# EAGLE schematic stm32_T12+858D (EAGLE 9.2.2)
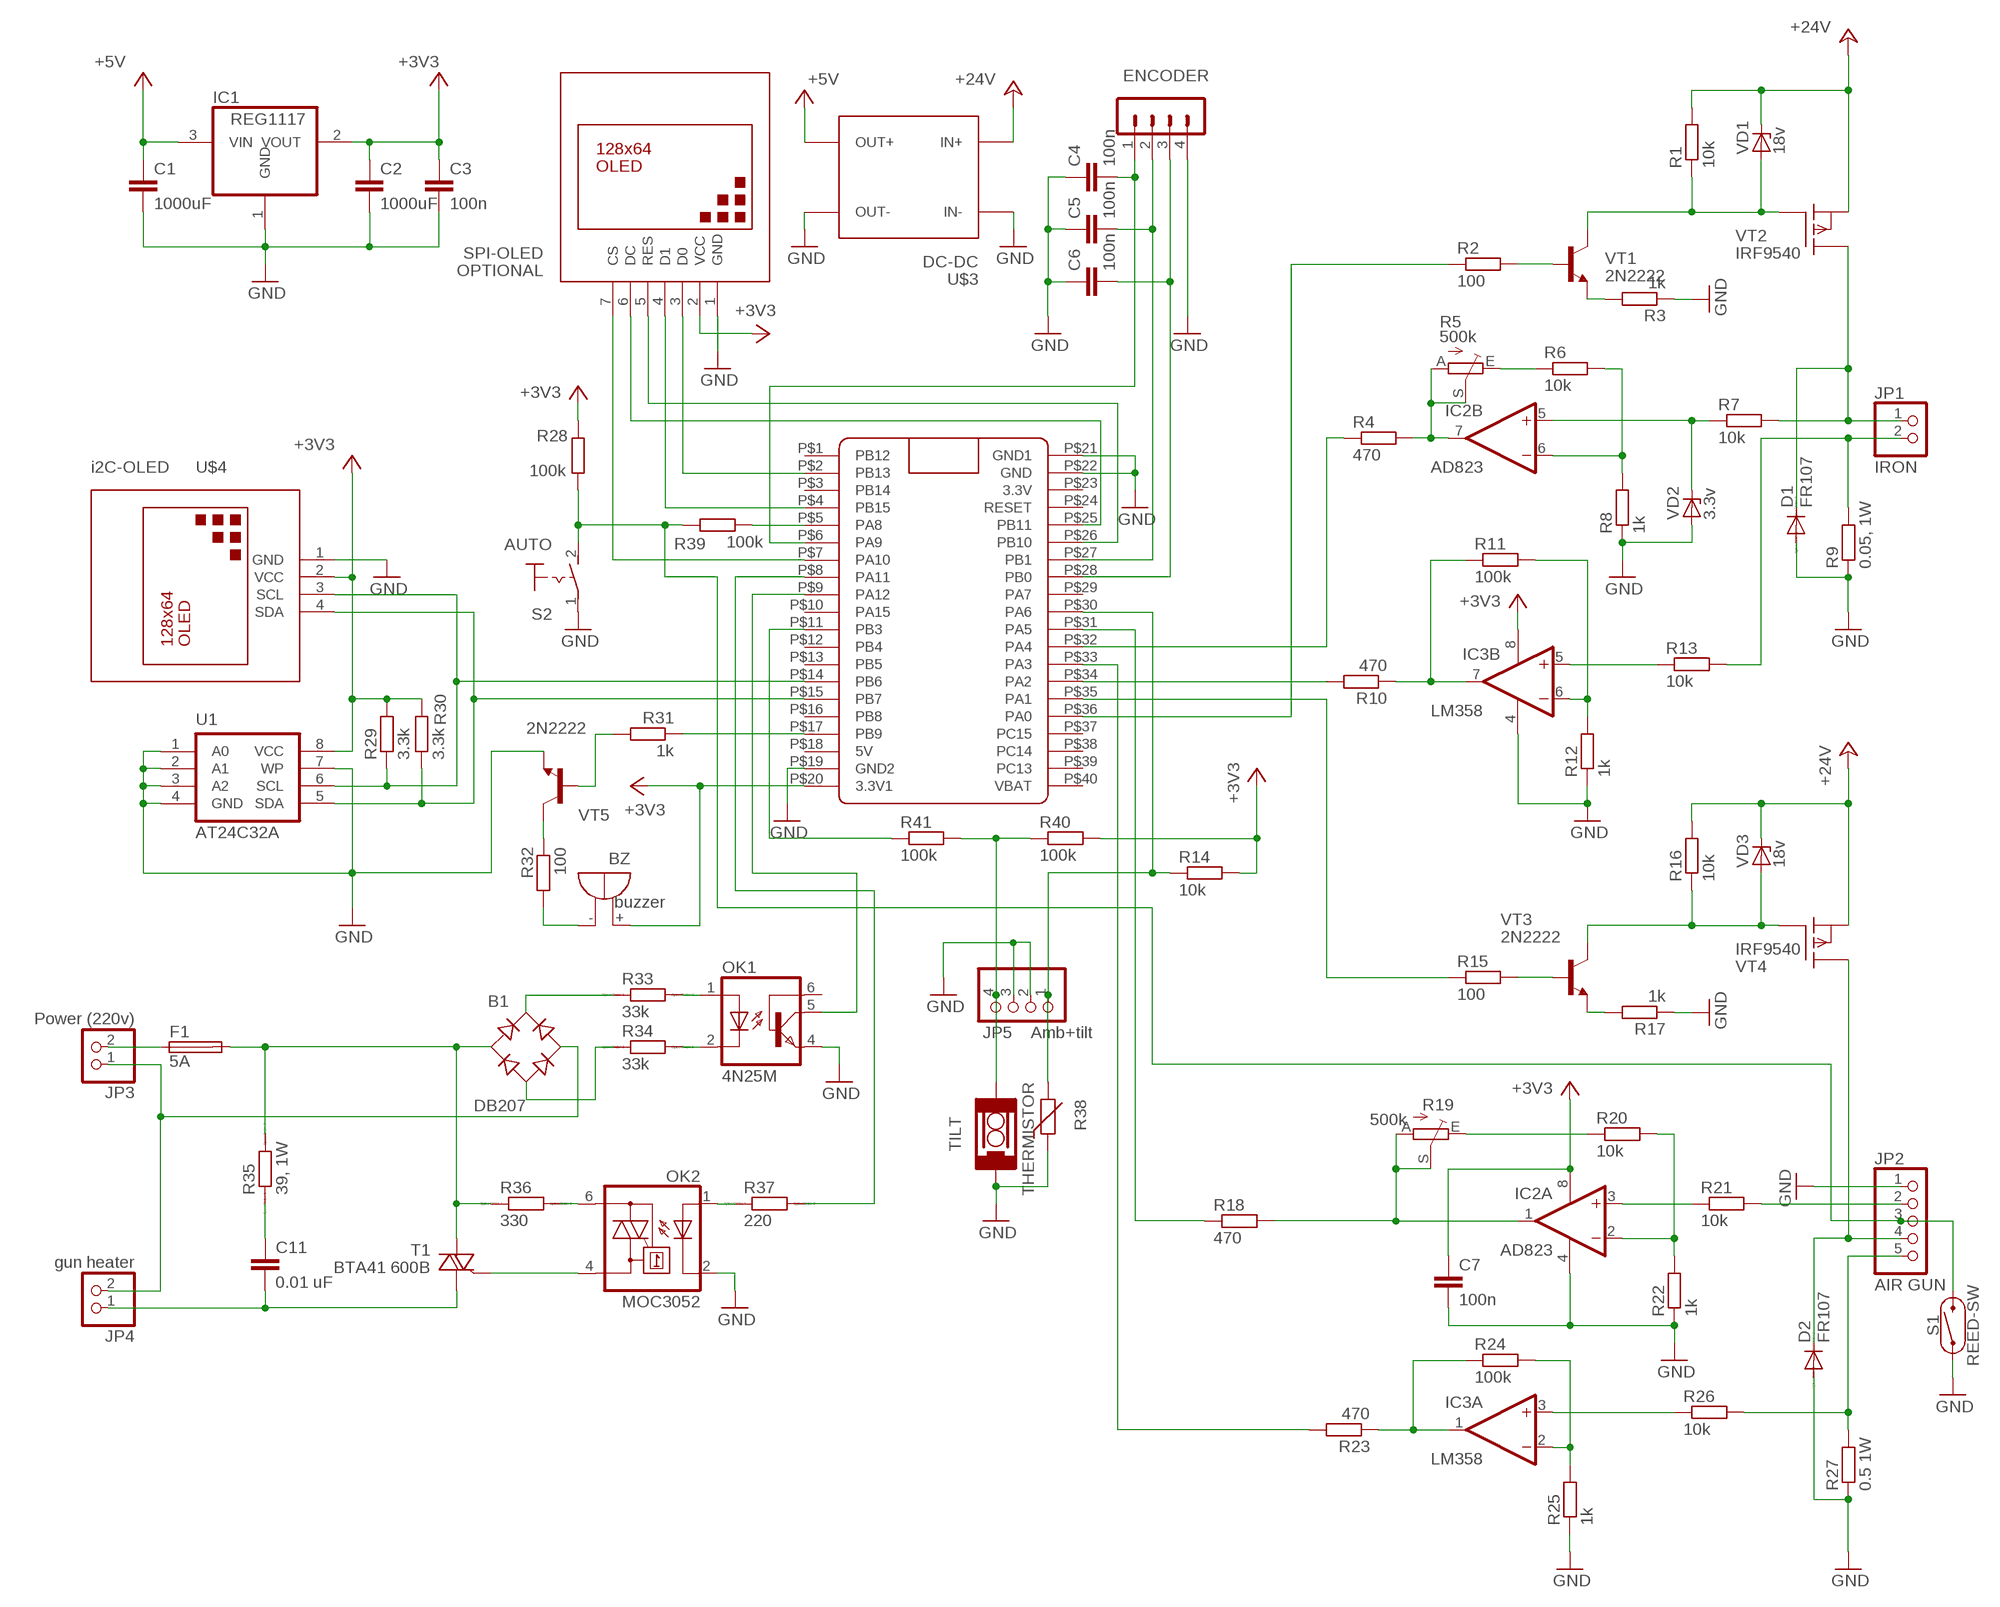
[diagram p0: schematic, sheet 1]

## Parts
B1  DB207  B-DIL  [B-DIL]
BZ  buzzer  EB2209A  [EB2209A]
C1  1000uF  C-EU025-025X050  [C025-025X050]
C2  1000uF  C-EU025-025X050  [C025-025X050]
C3  100n  C-EU025-025X050  [C025-025X050]
C4  100n  C-EU025-025X050  [C025-025X050]
C5  100n  C-EU025-025X050  [C025-025X050]
C6  100n  C-EU025-025X050  [C025-025X050]
C7  100n  C-EU025-025X050  [C025-025X050]
C11  0.01 uF  C-EU050-024X044  [C050-024X044]
D1  FR107  1N4004  [DO41-10]
D2  FR107  1N4004  [DO41-10]
ENCODER  MA04-1  [MA04-1]
F1  5A  TE5  [TE5]
IC1  REG1117  [SOT223]
IC2  AD823  MCP602P  [DIL08]
IC3  LM358  MCP602P  [DIL08]
JP1  IRON  PINHD-1X2  [1X02]
JP2  AIR GUN  PINHD-1X5  [1X05]
JP3  Power (220v)  PINHD-1X2  [1X02]
JP4  gun heater  PINHD-1X2  [1X02]
JP5  Amb+tilt  PINHD-1X4  [1X04]
OK1  4N25M  [DIL06]
OK2  MOC3052  MOC3021M  [DIL06]
OPTIONAL  SPI-OLED  DISPLAY-OLED-128X64  [DISPLAY-OLED-128X64]
R1  10k  R-EU_0204/5  [0204/5]
R2  100  R-EU_0204/5  [0204/5]
R3  1k  R-EU_0204/5  [0204/5]
R4  470  R-EU_0204/5  [0204/5]
R5  500k  TRIM_EU-RJ9W  [RJ9W]
R6  10k  R-EU_0204/5  [0204/5]
R7  10k  R-EU_0204/5  [0204/5]
R8  1k  R-EU_0204/5  [0204/5]
R9  0.05, 1W  R-EU_0204/5  [0204/5]
R10  470  R-EU_0204/5  [0204/5]
R11  100k  R-EU_0204/5  [0204/5]
R12  1k  R-EU_0204/5  [0204/5]
R13  10k  R-EU_0204/5  [0204/5]
R14  10k  R-EU_0204/5  [0204/5]
R15  100  R-EU_0204/5  [0204/5]
R16  10k  R-EU_0204/5  [0204/5]
R17  1k  R-EU_0204/5  [0204/5]
R18  470  R-EU_0204/5  [0204/5]
R19  500k  TRIM_EU-RJ9W  [RJ9W]
R20  10k  R-EU_0204/5  [0204/5]
R21  10k  R-EU_0204/5  [0204/5]
R22  1k  R-EU_0204/5  [0204/5]
R23  470  R-EU_0204/5  [0204/5]
R24  100k  R-EU_0204/5  [0204/5]
R25  1k  R-EU_0204/5  [0204/5]
R26  10k  R-EU_0204/5  [0204/5]
R27  0.5 1W  R-EU_0204/5  [0204/5]
R28  100k  R-EU_0204/5  [0204/5]
R29  3.3k  R-EU_0204/5  [0204/5]
R30  3.3k  R-EU_0204/5  [0204/5]
R31  1k  R-EU_0204/5  [0204/5]
R32  100  R-EU_0204/5  [0204/5]
R33  33k  R0204/7  [0204/7]
R34  33k  R0204/7  [0204/7]
R35  39, 1W  R0204/7  [0204/7]
R36  330  R0204/7  [0204/7]
R37  220  R0204/7  [0204/7]
R38  THERMISTOR  THERMISTOR-2,5  [RS-2,5]
R39  100k  R-EU_0204/5  [0204/5]
R40  100k  R-EU_0204/5  [0204/5]
R41  100k  R-EU_0204/5  [0204/5]
S1  REED-SW  REED_SWITCH-PTH-GLASS  [REED_SWITCH_GLASS]
S2  AUTO  MS243  [MS243]
T1  BTA41 600B  BTA26-H  [TOP3L-1]
TILT  SQ-SEN-200  [SQ-SEN-200]
U1  AT24C32A  AT24CXX-8S1  [SO08-8S1]
U$1  BLUE_PILL  [BLUE_PILL]
U$3  DC-DC  DC-DC-STEP-DOWN-MP2307  [DC-DC-STEP-DOWN-MP2307]
U$4  i2C-OLED  DISPLAY-OLED-128X64-I2C  [DISPLAY-OLED-128X64-I2C]
VD1  18v  ZENER-DIODEDO34-7  [DO34Z7]
VD2  3.3v  ZENER-DIODEDO34-7  [DO34Z7]
VD3  18v  ZENER-DIODEDO34-7  [DO34Z7]
VT1  2N2222  [TO18]
VT2  IRF9540  IRF9530  [TO220]
VT3  2N2222  [TO18]
VT4  IRF9540  IRF9530  [TO220]
VT5  2N2222  [TO18]

## Nets
+3V3: BZ.+ C2.1 C3.1 C7.1 IC1.2(VOUT) IC2.8(P:V+) IC3.8(P:V+) OPTIONAL.2(VCC) R14.2 R28.2 R29.2 R30.2 R40.2 U1.8(VCC) U$1.P$20(3.3V1) U$4.2(VCC)
+5V: C1.1 IC1.3(VIN) U$3.OUT+
+24V: R1.2 R16.2 U$3.IN+ VD1.C VD3.C VT2.3(S) VT4.3(S)
GND: C1.2 C2.2 C3.2 C4.1 C5.1 C6.1 D1.A D2.A ENCODER.4 IC1.1(GND) IC3.4(P:V-) JP2.1 JP5.2 JP5.3 OK1.4(EMI) OK2.2(C) OPTIONAL.1(GND) R3.1 R9.1 R12.1 R17.1 R25.1 R27.1 R38.1 S1.P$1 S2.1(P) TILT.1 U1.1(A0) U1.2(A1) U1.3(A2) U1.4(GND) U1.7(WP) U$1.P$19(GND2) U$1.P$21(GND1) U$1.P$22(GND) U$3.IN- U$3.OUT- U$4.1(GND) VT5.1(E)
N$1: R30.1 U1.5(SDA) U$1.P$15(PB7) U$4.4(SDA)
N$2: R29.1 U1.6(SCL) U$1.P$14(PB6) U$4.3(SCL)
N$3: OPTIONAL.7(CS) U$1.P$7(PA10)
N$4: OPTIONAL.6(DC) U$1.P$25(PB11)
N$5: OPTIONAL.5(RES) U$1.P$26(PB10)
N$6: OPTIONAL.4(D1) U$1.P$4(PB15)
N$7: OPTIONAL.3(D0) U$1.P$2(PB13)
N$8: R31.1 U$1.P$17(PB9)
N$9: C6.2 ENCODER.3 U$1.P$28(PB0)
N$10: C5.2 ENCODER.2 U$1.P$27(PB1)
N$11: C4.2 ENCODER.1 U$1.P$6(PA9)
N$12: R5.E R6.1
N$13: R4.1 U$1.P$32(PA4)
N$14: IC2.6(B:-IN) R6.2 R8.2
N$15: IC2.5(B:+IN) R7.1 VD2.C
N$16: D1.C JP1.1 R7.2 VT2.2(D)
N$17: IC2.3(A:+IN) R21.1
N$18: IC3.7(B:OUT) R10.1 R11.1
N$19: IC3.6(B:-IN) R11.2 R12.2
N$20: IC2.7(B:OUT) R4.2 R5.A R5.S
N$21: R10.2 U$1.P$34(PA2)
N$22: IC3.5(B:+IN) R13.1
N$23: R1.1 VD1.A VT1.3(C) VT2.1(G)
N$24: IC2.2(A:-IN) R20.2 R22.2
N$25: R23.2 U$1.P$33(PA3)
N$26: R3.2 VT1.1(E)
N$27: R2.2 VT1.2(B)
N$28: R2.1 U$1.P$36(PA0)
N$29: JP5.1 R14.1 R38.2 U$1.P$30(PA6)
N$30: R31.2 VT5.2(B)
N$31: D2.C JP2.4 VT4.2(D)
N$32: IC3.1(A:OUT) R23.1 R24.1
N$33: IC3.2(A:-IN) R24.2 R25.2
N$34: JP1.2 R9.2 R13.2
N$35: JP2.2 R21.2
N$36: JP2.3 R28.1 R39.1 S1.P$2 S2.2(S)
N$37: BZ.- R32.2
N$39: IC2.1(A:OUT) R18.2 R19.A R19.S
N$40: B1.AC2 JP3.1 JP4.2
N$41: IC3.3(A:+IN) R26.1
N$42: R19.E R20.1
N$43: R18.1 U$1.P$31(PA5)
N$44: C11.2 JP4.1 T1.A1
N$45: C11.1 R35.1
N$46: B1.AC1 F1.2 R35.2 R36.1 T1.A2
N$47: OK2.4(A1) T1.G
N$48: OK2.6(A2) R36.2
N$49: OK2.1(A) R37.1
N$50: R16.1 VD3.A VT3.3(C) VT4.1(G)
N$51: B1.+ R33.1
N$52: OK1.1(A) R33.2
N$53: OK1.2(C) R34.2
N$54: B1.- R34.1
N$55: OK1.5(COL) U$1.P$9(PA12)
N$56: R17.2 VT3.1(E)
N$57: R15.2 VT3.2(B)
N$58: R15.1 U$1.P$35(PA1)
N$59: R32.1 VT5.3(C)
N$60: R37.2 U$1.P$8(PA11)
N$61: JP2.5 R26.2 R27.2
N$62: F1.1 JP3.2
N$63: R41.1 U$1.P$11(PB3)
N$64: JP5.4 R40.1 R41.2 TILT.2
N$65: R39.2 U$1.P$5(PA8)
VD3: C7.2 IC2.4(P:V-) R8.1 R22.1 VD2.A ; supply symbol labelled GND
Unconnected: OK1.6(BAS) U$1.P$1(PB12) U$1.P$3(PB14) U$1.P$10(PA15) U$1.P$12(PB4) U$1.P$13(PB5) U$1.P$16(PB8) U$1.P$18(5V) U$1.P$23(3.3V) U$1.P$24(RESET) U$1.P$29(PA7) U$1.P$37(PC15) U$1.P$38(PC14) U$1.P$39(PC13) U$1.P$40(VBAT)

## Library data of the parts
B1 = rectifier:B-DIL: RECTIFIER
BZ = buzzer:EB2209A: BUZZER Source: Buerklin; OC_FARNELL: unknown; OC_NEWARK: unknown
C1-C7 C11 = rcl:C-EU: CAPACITOR, European symbol; SPICEPREFIX: C
D1 D2 = diode:1N4004: DIODE general purpose rectifier, 1 A
ENCODER = con-lstb:MA04-1: PIN HEADER; OC_FARNELL: unknown; OC_NEWARK: unknown
F1 = fuse:TE5: FUSE Wickmann; OC_FARNELL: unknown; OC_NEWARK: unknown
IC1 = burr-brown:REG1117: 800mA and 1A Low Dropout (LDO) Positive Regulator 1.8V, 2.5V, 2.85V, 3.3V, 5V, and Adj; MPN: REG1117; OC_FARNELL: 1097566; OC_NEWARK: 14P6981
IC2 IC3 = linear:MCP602: Single Op Amp 2.7V to 6.0V Single Supply CMOS Source: http://ww1.microchip.com/downloads/en/DeviceDoc/21314g.pdf
JP1 JP3 JP4 = pinhead:PINHD-1X2: PIN HEADER
JP2 = pinhead:PINHD-1X5: PIN HEADER
JP5 = pinhead:PINHD-1X4: PIN HEADER
OK1 = optocoupler:4N*?M: General Purpose 6-Pin Phototransistor Optocouplers Source: http://www.fairchildsemi.com/ds/4N/4N35-M.pdf; MPN: 4N25-M; OC_FARNELL: 1021349; OC_NEWARK: 98K9084
OK2 = optocoupler:MOC30*M: RANDOM-PHASE OPTOISOLATORS TRIAC DRIVER OUTPUT Source: http://www.fairchildsemi.com MOC3020-M.pdf; MF: FAIRCHILD SEMICONDUCTOR; MPN: MOC3021-M; OC_FARNELL: 1021365; OC_NEWARK: 95B7895
OPTIONAL = diy-modules:DISPLAY-OLED-128X64: 128x64 Dot Matrix OLED Module based on SSD1306 chip Variant with SPI interface More details available here: http://www.instructables.com/id/How-to-use-OLED-display-arduino-module/ SSD1306 datasheet: https://cdn-shop.adafruit.com/datasheets/SSD1306.pdf Click here to find device on ebay.com <http://www.ebay.com/sch/oled+display+128x64> Note: There are two variants: I2C and SPI. Search for the proper version.
R1-R4 R6-R18 R20-R32 R39-R41 = rcl:R-EU_: RESISTOR, European symbol; SPICEPREFIX: R
R5 R19 = pot:TRIM_EU-: POTENTIOMETER
R33-R37 = eagle-ltspice:R: RESISTOR, European symbol; SPICEMODEL: NONE; SPICEPREFIX: R
R38 = varistor:THERMISTOR: THERMISTOR
S1 = SparkFun-Switches:REED_SWITCH: Reed Switch A reed switch is a magnetically-actuated switch. When the device is exposed to a magnetic field, the two ferrous materials inside the switch pull together and the switch closes. Variant Overview PTH-GLASS Reed Switch <https://www.sparkfun.com/products/8642> (COM-08642) - PTH reed switch w/ glass body (6.0 x 0.9 mm) PTH-INSULATED Reed Switch - Insulated <https://www.sparkfun.com/products/10601> (COM-10601) - PTH reed switch w/ insulated body (15.1 x 4.2 mm); PROD_ID: SWCH-09282; SF_SKU: COM-08642
S2 = switch:MS243: TOGGLE SWITCH
T1 = triac:BTA26: 25A TRIAC Source: http://www.st.com/stonline/products/literature/ds/7470.pdf
TILT = sensor-signalquest:SQ-SEN-200: TILT AND VIBRATION SENSOR OMNIDIRECTIONAL
U1 = memory-atmel:AT24CXX: EEPROM I2C serial bus
U$1 = BluePill:BLUE_PILL
U$3 = diy-modules:DC-DC-STEP-DOWN-MP2307: DC/DC Step-Down Regulator based on MP2307DN chip MP2307 datasheet available here: https://cdn-shop.adafruit.com/datasheets/MP2307_r1.9.pdf Click here to find device on ebay.com <http://www.ebay.com/sch/dc+dc+3a+mini+converter>
U$4 = diy-modules:DISPLAY-OLED-128X64-I2C: 128x64 Dot Matrix OLED Module based on SSD1306 chip Variant with I2C interface More details available here: http://www.instructables.com/id/Monochrome-096-i2c-OLED-display-with-arduino-SSD13/ SSD1306 datasheet: https://cdn-shop.adafruit.com/datasheets/SSD1306.pdf Click here to find device on ebay.com <http://www.ebay.com/sch/oled+display+128x64+iic> Note: There are two variants: I2C and SPI. Search for the proper version.
VD1-VD3 = diode:ZENER-DIODE: Z-Diode
VT1 VT3 VT5 = transistor:2N2222: NPN TRANSISTOR
VT2 VT4 = transistor-fet:IRF9530: P-Channel Enhancement MOSFET (HEXFET); -100V; -12A; 0,3Ohm